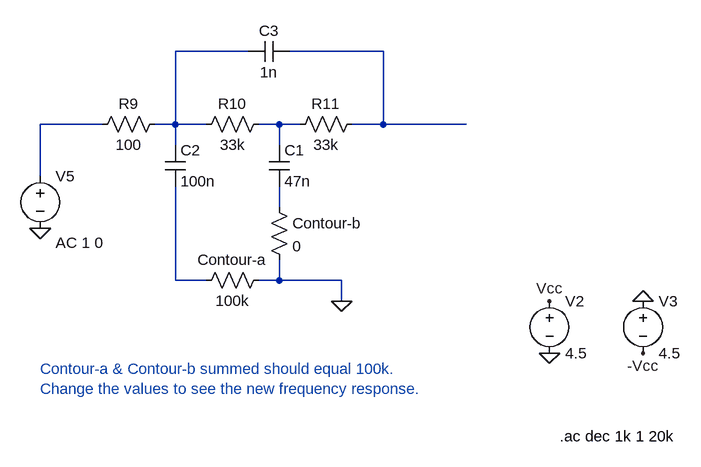
[diagram p0: schematic contour.asc]
contour.asc, the LTspice schematic file:
Version 4
SHEET 1 4756 800
WIRE -96 -48 -208 -48
WIRE 112 -48 -32 -48
WIRE -320 64 -416 64
WIRE -208 64 -208 -48
WIRE -208 64 -240 64
WIRE -160 64 -208 64
WIRE -48 64 -80 64
WIRE -16 64 -48 64
WIRE 112 64 112 -48
WIRE 112 64 64 64
WIRE 240 64 112 64
WIRE -208 96 -208 64
WIRE -48 96 -48 64
WIRE -416 144 -416 64
WIRE -48 192 -48 160
WIRE -208 304 -208 160
WIRE -160 304 -208 304
WIRE -48 304 -48 272
WIRE -48 304 -80 304
WIRE 48 304 -48 304
WIRE 48 336 48 304
FLAG 368 416 0
FLAG 512 336 0
FLAG 368 336 Vcc
FLAG 512 416 -Vcc
FLAG -416 224 0
FLAG 48 336 0
SYMBOL voltage 368 320 R0
SYMATTR InstName V2
SYMATTR Value 4.5
SYMBOL voltage 512 320 R0
SYMATTR InstName V3
SYMATTR Value 4.5
SYMBOL voltage -416 128 R0
WINDOW 123 24 118 Left 2
SYMATTR Value2 AC 1 0
SYMATTR InstName V5
SYMATTR Value ""
SYMBOL res -224 48 R90
WINDOW 0 0 56 VBottom 2
WINDOW 3 32 56 VTop 2
SYMATTR InstName R9
SYMATTR Value 100
SYMBOL res -64 48 R90
WINDOW 0 0 56 VBottom 2
WINDOW 3 32 56 VTop 2
SYMATTR InstName R10
SYMATTR Value 33k
SYMBOL res 80 48 R90
WINDOW 0 0 56 VBottom 2
WINDOW 3 32 56 VTop 2
SYMATTR InstName R11
SYMATTR Value 33k
SYMBOL res -64 176 R0
SYMATTR InstName Contour-b
SYMATTR Value 0
SYMBOL res -64 288 R90
WINDOW 0 0 56 VBottom 2
WINDOW 3 32 56 VTop 2
SYMATTR InstName Contour-a
SYMATTR Value 100k
SYMBOL cap -64 96 R0
SYMATTR InstName C1
SYMATTR Value 47n
SYMBOL cap -224 96 R0
SYMATTR InstName C2
SYMATTR Value 100n
SYMBOL cap -32 -64 R90
WINDOW 0 0 32 VBottom 2
WINDOW 3 32 32 VTop 2
SYMATTR InstName C3
SYMATTR Value 1n
TEXT 384 544 Left 2 !.ac dec 1k 1 20k
TEXT -416 440 Left 2 ;Contour-a & Contour-b summed should equal 100k. \nChange the values to see the new frequency response.

The netlist it stands for:
* contour.asc
V2 Vcc 0 4.5
V3 0 -Vcc 4.5
V5 N003 0 AC 1 0
R9 N001 N003 100
R10 N004 N001 33k
R11 N002 N004 33k
R§Contour-b N005 0 0
R§Contour-a 0 N006 100k
C1 N004 N005 47n
C2 N001 N006 100n
C3 N002 N001 1n
.ac dec 1k 1 20k
* Contour-a & Contour-b summed should equal 100k.
* Change the values to see the new frequency response.
.backanno
.end